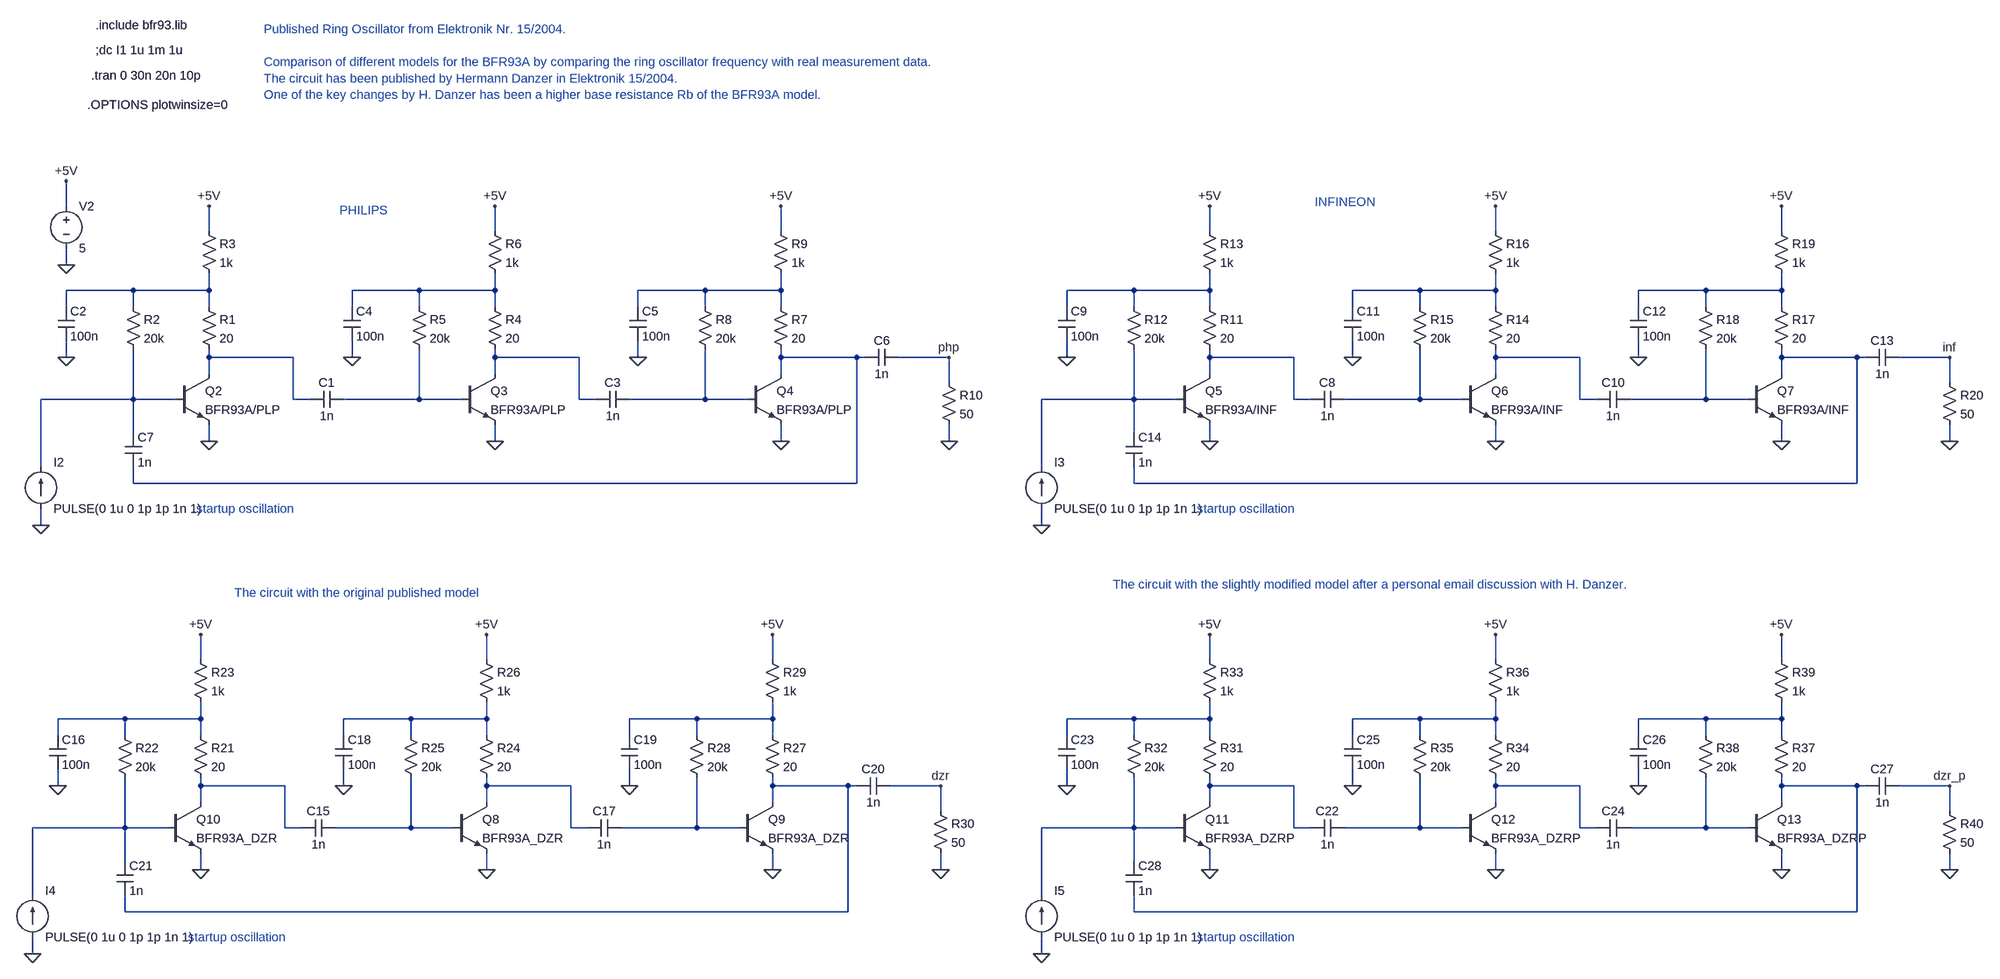
[diagram p0: schematic bfr93.asc]
bfr93.asc, the LTspice schematic file:
Version 4
SHEET 1 3400 3092
WIRE -304 1008 -304 1040
WIRE -304 784 -304 752
WIRE -304 752 -448 752
WIRE -304 752 -304 720
WIRE -576 752 -576 784
WIRE -448 784 -448 752
WIRE -448 752 -576 752
WIRE -304 864 -304 880
WIRE -368 960 -448 960
WIRE -448 960 -448 864
WIRE -576 848 -576 880
WIRE -304 640 -304 592
WIRE -112 960 -144 960
WIRE -144 960 -144 880
WIRE -144 880 -304 880
WIRE -304 880 -304 912
WIRE -48 960 96 960
WIRE 240 1008 240 1040
WIRE 240 784 240 752
WIRE 240 752 96 752
WIRE 240 752 240 720
WIRE -32 752 -32 784
WIRE 96 784 96 752
WIRE 96 752 -32 752
WIRE 240 864 240 880
WIRE 176 960 96 960
WIRE 96 960 96 864
WIRE -32 848 -32 880
WIRE 240 640 240 592
WIRE 432 960 400 960
WIRE 400 960 400 880
WIRE 400 880 240 880
WIRE 240 880 240 912
WIRE 496 960 640 960
WIRE 784 1008 784 1040
WIRE 784 784 784 752
WIRE 784 752 640 752
WIRE 784 752 784 720
WIRE 512 752 512 784
WIRE 640 784 640 752
WIRE 640 752 512 752
WIRE 784 864 784 880
WIRE 720 960 640 960
WIRE 640 960 640 864
WIRE 512 848 512 880
WIRE 784 640 784 592
WIRE 1104 1008 1104 1040
WIRE 1104 928 1104 880
WIRE 1104 880 1008 880
WIRE 784 880 784 912
WIRE 944 880 928 880
WIRE -448 1088 -448 1120
WIRE -448 1120 928 1120
WIRE 928 1120 928 880
WIRE 928 880 784 880
WIRE -448 1024 -448 960
WIRE -624 1088 -624 960
WIRE -624 960 -448 960
WIRE -624 1168 -624 1200
WIRE -576 672 -576 704
WIRE -576 592 -576 544
WIRE 1600 1008 1600 1040
WIRE 1600 784 1600 752
WIRE 1600 752 1456 752
WIRE 1600 752 1600 720
WIRE 1328 752 1328 784
WIRE 1456 784 1456 752
WIRE 1456 752 1328 752
WIRE 1600 864 1600 880
WIRE 1536 960 1456 960
WIRE 1456 960 1456 864
WIRE 1328 848 1328 880
WIRE 1600 640 1600 592
WIRE 1792 960 1760 960
WIRE 1760 960 1760 880
WIRE 1760 880 1600 880
WIRE 1600 880 1600 912
WIRE 1856 960 2000 960
WIRE 2144 1008 2144 1040
WIRE 2144 784 2144 752
WIRE 2144 752 2000 752
WIRE 2144 752 2144 720
WIRE 1872 752 1872 784
WIRE 2000 784 2000 752
WIRE 2000 752 1872 752
WIRE 2144 864 2144 880
WIRE 2080 960 2000 960
WIRE 2000 960 2000 864
WIRE 1872 848 1872 880
WIRE 2144 640 2144 592
WIRE 2336 960 2304 960
WIRE 2304 960 2304 880
WIRE 2304 880 2144 880
WIRE 2144 880 2144 912
WIRE 2400 960 2544 960
WIRE 2688 1008 2688 1040
WIRE 2688 784 2688 752
WIRE 2688 752 2544 752
WIRE 2688 752 2688 720
WIRE 2416 752 2416 784
WIRE 2544 784 2544 752
WIRE 2544 752 2416 752
WIRE 2688 864 2688 880
WIRE 2624 960 2544 960
WIRE 2544 960 2544 864
WIRE 2416 848 2416 880
WIRE 2688 640 2688 592
WIRE 3008 1008 3008 1040
WIRE 3008 928 3008 880
WIRE 3008 880 2912 880
WIRE 2688 880 2688 912
WIRE 2848 880 2832 880
WIRE 1456 1088 1456 1120
WIRE 1456 1120 2832 1120
WIRE 2832 1120 2832 880
WIRE 2832 880 2688 880
WIRE 1456 1024 1456 960
WIRE 1280 1088 1280 960
WIRE 1280 960 1456 960
WIRE 1280 1168 1280 1200
WIRE -320 1824 -320 1856
WIRE -320 1600 -320 1568
WIRE -320 1568 -464 1568
WIRE -320 1568 -320 1536
WIRE -592 1568 -592 1600
WIRE -464 1600 -464 1568
WIRE -464 1568 -592 1568
WIRE -320 1680 -320 1696
WIRE -384 1776 -464 1776
WIRE -464 1776 -464 1680
WIRE -592 1664 -592 1696
WIRE -320 1456 -320 1408
WIRE -128 1776 -160 1776
WIRE -160 1776 -160 1696
WIRE -160 1696 -320 1696
WIRE -320 1696 -320 1728
WIRE -64 1776 80 1776
WIRE 224 1824 224 1856
WIRE 224 1600 224 1568
WIRE 224 1568 80 1568
WIRE 224 1568 224 1536
WIRE -48 1568 -48 1600
WIRE 80 1600 80 1568
WIRE 80 1568 -48 1568
WIRE 224 1680 224 1696
WIRE 160 1776 80 1776
WIRE 80 1776 80 1680
WIRE -48 1664 -48 1696
WIRE 224 1456 224 1408
WIRE 416 1776 384 1776
WIRE 384 1776 384 1696
WIRE 384 1696 224 1696
WIRE 224 1696 224 1728
WIRE 480 1776 624 1776
WIRE 768 1824 768 1856
WIRE 768 1600 768 1568
WIRE 768 1568 624 1568
WIRE 768 1568 768 1536
WIRE 496 1568 496 1600
WIRE 624 1600 624 1568
WIRE 624 1568 496 1568
WIRE 768 1680 768 1696
WIRE 704 1776 624 1776
WIRE 624 1776 624 1680
WIRE 496 1664 496 1696
WIRE 768 1456 768 1408
WIRE 1088 1824 1088 1856
WIRE 1088 1744 1088 1696
WIRE 1088 1696 992 1696
WIRE 768 1696 768 1728
WIRE 928 1696 912 1696
WIRE -464 1904 -464 1936
WIRE -464 1936 912 1936
WIRE 912 1936 912 1696
WIRE 912 1696 768 1696
WIRE -464 1840 -464 1776
WIRE -640 1904 -640 1776
WIRE -640 1776 -464 1776
WIRE -640 1984 -640 2016
WIRE 1600 1824 1600 1856
WIRE 1600 1600 1600 1568
WIRE 1600 1568 1456 1568
WIRE 1600 1568 1600 1536
WIRE 1328 1568 1328 1600
WIRE 1456 1600 1456 1568
WIRE 1456 1568 1328 1568
WIRE 1600 1680 1600 1696
WIRE 1536 1776 1456 1776
WIRE 1456 1776 1456 1680
WIRE 1328 1664 1328 1696
WIRE 1600 1456 1600 1408
WIRE 1792 1776 1760 1776
WIRE 1760 1776 1760 1696
WIRE 1760 1696 1600 1696
WIRE 1600 1696 1600 1728
WIRE 1856 1776 2000 1776
WIRE 2144 1824 2144 1856
WIRE 2144 1600 2144 1568
WIRE 2144 1568 2000 1568
WIRE 2144 1568 2144 1536
WIRE 1872 1568 1872 1600
WIRE 2000 1600 2000 1568
WIRE 2000 1568 1872 1568
WIRE 2144 1680 2144 1696
WIRE 2080 1776 2000 1776
WIRE 2000 1776 2000 1680
WIRE 1872 1664 1872 1696
WIRE 2144 1456 2144 1408
WIRE 2336 1776 2304 1776
WIRE 2304 1776 2304 1696
WIRE 2304 1696 2144 1696
WIRE 2144 1696 2144 1728
WIRE 2400 1776 2544 1776
WIRE 2688 1824 2688 1856
WIRE 2688 1600 2688 1568
WIRE 2688 1568 2544 1568
WIRE 2688 1568 2688 1536
WIRE 2416 1568 2416 1600
WIRE 2544 1600 2544 1568
WIRE 2544 1568 2416 1568
WIRE 2688 1680 2688 1696
WIRE 2624 1776 2544 1776
WIRE 2544 1776 2544 1680
WIRE 2416 1664 2416 1696
WIRE 2688 1456 2688 1408
WIRE 3008 1824 3008 1856
WIRE 3008 1744 3008 1696
WIRE 3008 1696 2912 1696
WIRE 2688 1696 2688 1728
WIRE 2848 1696 2832 1696
WIRE 1456 1904 1456 1936
WIRE 1456 1936 2832 1936
WIRE 2832 1936 2832 1696
WIRE 2832 1696 2688 1696
WIRE 1456 1840 1456 1776
WIRE 1280 1904 1280 1776
WIRE 1280 1776 1456 1776
WIRE 1280 1984 1280 2016
FLAG -304 1040 0
FLAG -576 880 0
FLAG -304 592 +5V
FLAG -624 1200 0
FLAG 240 1040 0
FLAG -32 880 0
FLAG 240 592 +5V
FLAG 784 1040 0
FLAG 512 880 0
FLAG 784 592 +5V
FLAG 1104 1040 0
FLAG -576 544 +5V
FLAG -576 704 0
FLAG 1600 1040 0
FLAG 1328 880 0
FLAG 1600 592 +5V
FLAG 1280 1200 0
FLAG 2144 1040 0
FLAG 1872 880 0
FLAG 2144 592 +5V
FLAG 2688 1040 0
FLAG 2416 880 0
FLAG 2688 592 +5V
FLAG 3008 1040 0
FLAG 1104 880 php
FLAG 3008 880 inf
FLAG -320 1856 0
FLAG -592 1696 0
FLAG -320 1408 +5V
FLAG -640 2016 0
FLAG 224 1856 0
FLAG -48 1696 0
FLAG 224 1408 +5V
FLAG 768 1856 0
FLAG 496 1696 0
FLAG 768 1408 +5V
FLAG 1088 1856 0
FLAG 1088 1696 dzr
FLAG 1600 1856 0
FLAG 1328 1696 0
FLAG 1600 1408 +5V
FLAG 1280 2016 0
FLAG 2144 1856 0
FLAG 1872 1696 0
FLAG 2144 1408 +5V
FLAG 2688 1856 0
FLAG 2416 1696 0
FLAG 2688 1408 +5V
FLAG 3008 1856 0
FLAG 3008 1696 dzr_p
SYMBOL npn -368 912 R0
SYMATTR InstName Q2
SYMATTR Value BFR93A/PLP
SYMATTR Prefix X
SYMBOL res -320 768 R0
SYMATTR InstName R1
SYMATTR Value 20
SYMBOL res -464 768 R0
SYMATTR InstName R2
SYMATTR Value 20k
SYMBOL res -320 624 R0
SYMATTR InstName R3
SYMATTR Value 1k
SYMBOL cap -112 976 R270
WINDOW 0 32 32 VTop 0
WINDOW 3 0 32 VBottom 0
SYMATTR InstName C1
SYMATTR Value 1n
SYMBOL cap -592 784 R0
SYMATTR InstName C2
SYMATTR Value 100n
SYMBOL npn 176 912 R0
SYMATTR InstName Q3
SYMATTR Value BFR93A/PLP
SYMATTR Prefix X
SYMBOL res 224 768 R0
SYMATTR InstName R4
SYMATTR Value 20
SYMBOL res 80 768 R0
SYMATTR InstName R5
SYMATTR Value 20k
SYMBOL res 224 624 R0
SYMATTR InstName R6
SYMATTR Value 1k
SYMBOL cap 432 976 R270
WINDOW 0 32 32 VTop 0
WINDOW 3 0 32 VBottom 0
SYMATTR InstName C3
SYMATTR Value 1n
SYMBOL cap -48 784 R0
SYMATTR InstName C4
SYMATTR Value 100n
SYMBOL npn 720 912 R0
SYMATTR InstName Q4
SYMATTR Value BFR93A/PLP
SYMATTR Prefix X
SYMBOL res 768 768 R0
SYMATTR InstName R7
SYMATTR Value 20
SYMBOL res 624 768 R0
SYMATTR InstName R8
SYMATTR Value 20k
SYMBOL res 768 624 R0
SYMATTR InstName R9
SYMATTR Value 1k
SYMBOL cap 496 784 R0
SYMATTR InstName C5
SYMATTR Value 100n
SYMBOL cap 944 896 R270
WINDOW 0 32 32 VTop 0
WINDOW 3 0 32 VBottom 0
SYMATTR InstName C6
SYMATTR Value 1n
SYMBOL res 1088 912 R0
SYMATTR InstName R10
SYMATTR Value 50
SYMBOL cap -464 1024 R0
SYMATTR InstName C7
SYMATTR Value 1n
SYMBOL current -624 1168 M180
WINDOW 0 24 88 Left 0
WINDOW 3 24 0 Left 0
WINDOW 123 0 0 Left 0
WINDOW 39 0 0 Left 0
SYMATTR InstName I2
SYMATTR Value PULSE(0 1u 0 1p 1p 1n 1)
SYMBOL voltage -576 576 R0
SYMATTR InstName V2
SYMATTR Value 5
SYMBOL npn 1536 912 R0
SYMATTR InstName Q5
SYMATTR Value BFR93A/INF
SYMATTR Prefix X
SYMBOL res 1584 768 R0
SYMATTR InstName R11
SYMATTR Value 20
SYMBOL res 1440 768 R0
SYMATTR InstName R12
SYMATTR Value 20k
SYMBOL res 1584 624 R0
SYMATTR InstName R13
SYMATTR Value 1k
SYMBOL cap 1792 976 R270
WINDOW 0 32 32 VTop 0
WINDOW 3 0 32 VBottom 0
SYMATTR InstName C8
SYMATTR Value 1n
SYMBOL cap 1312 784 R0
SYMATTR InstName C9
SYMATTR Value 100n
SYMBOL npn 2080 912 R0
SYMATTR InstName Q6
SYMATTR Value BFR93A/INF
SYMATTR Prefix X
SYMBOL res 2128 768 R0
SYMATTR InstName R14
SYMATTR Value 20
SYMBOL res 1984 768 R0
SYMATTR InstName R15
SYMATTR Value 20k
SYMBOL res 2128 624 R0
SYMATTR InstName R16
SYMATTR Value 1k
SYMBOL cap 2336 976 R270
WINDOW 0 32 32 VTop 0
WINDOW 3 0 32 VBottom 0
SYMATTR InstName C10
SYMATTR Value 1n
SYMBOL cap 1856 784 R0
SYMATTR InstName C11
SYMATTR Value 100n
SYMBOL npn 2624 912 R0
SYMATTR InstName Q7
SYMATTR Value BFR93A/INF
SYMATTR Prefix X
SYMBOL res 2672 768 R0
SYMATTR InstName R17
SYMATTR Value 20
SYMBOL res 2528 768 R0
SYMATTR InstName R18
SYMATTR Value 20k
SYMBOL res 2672 624 R0
SYMATTR InstName R19
SYMATTR Value 1k
SYMBOL cap 2400 784 R0
SYMATTR InstName C12
SYMATTR Value 100n
SYMBOL cap 2848 896 R270
WINDOW 0 32 32 VTop 0
WINDOW 3 0 32 VBottom 0
SYMATTR InstName C13
SYMATTR Value 1n
SYMBOL res 2992 912 R0
SYMATTR InstName R20
SYMATTR Value 50
SYMBOL cap 1440 1024 R0
SYMATTR InstName C14
SYMATTR Value 1n
SYMBOL current 1280 1168 M180
WINDOW 0 24 88 Left 0
WINDOW 3 24 0 Left 0
WINDOW 123 0 0 Left 0
WINDOW 39 0 0 Left 0
SYMATTR InstName I3
SYMATTR Value PULSE(0 1u 0 1p 1p 1n 1)
SYMBOL res -336 1584 R0
SYMATTR InstName R21
SYMATTR Value 20
SYMBOL res -480 1584 R0
SYMATTR InstName R22
SYMATTR Value 20k
SYMBOL res -336 1440 R0
SYMATTR InstName R23
SYMATTR Value 1k
SYMBOL cap -128 1792 R270
WINDOW 0 32 32 VTop 0
WINDOW 3 0 32 VBottom 0
SYMATTR InstName C15
SYMATTR Value 1n
SYMBOL cap -608 1600 R0
SYMATTR InstName C16
SYMATTR Value 100n
SYMBOL res 208 1584 R0
SYMATTR InstName R24
SYMATTR Value 20
SYMBOL res 64 1584 R0
SYMATTR InstName R25
SYMATTR Value 20k
SYMBOL res 208 1440 R0
SYMATTR InstName R26
SYMATTR Value 1k
SYMBOL cap 416 1792 R270
WINDOW 0 32 32 VTop 0
WINDOW 3 0 32 VBottom 0
SYMATTR InstName C17
SYMATTR Value 1n
SYMBOL cap -64 1600 R0
SYMATTR InstName C18
SYMATTR Value 100n
SYMBOL res 752 1584 R0
SYMATTR InstName R27
SYMATTR Value 20
SYMBOL res 608 1584 R0
SYMATTR InstName R28
SYMATTR Value 20k
SYMBOL res 752 1440 R0
SYMATTR InstName R29
SYMATTR Value 1k
SYMBOL cap 480 1600 R0
SYMATTR InstName C19
SYMATTR Value 100n
SYMBOL cap 928 1712 R270
WINDOW 0 32 32 VTop 0
WINDOW 3 0 32 VBottom 0
SYMATTR InstName C20
SYMATTR Value 1n
SYMBOL res 1072 1728 R0
SYMATTR InstName R30
SYMATTR Value 50
SYMBOL cap -480 1840 R0
SYMATTR InstName C21
SYMATTR Value 1n
SYMBOL current -640 1984 M180
WINDOW 0 24 88 Left 0
WINDOW 3 24 0 Left 0
WINDOW 123 0 0 Left 0
WINDOW 39 0 0 Left 0
SYMATTR InstName I4
SYMATTR Value PULSE(0 1u 0 1p 1p 1n 1)
SYMBOL npn 1536 1728 R0
SYMATTR InstName Q11
SYMATTR Value BFR93A_DZRP
SYMATTR Prefix X
SYMBOL res 1584 1584 R0
SYMATTR InstName R31
SYMATTR Value 20
SYMBOL res 1440 1584 R0
SYMATTR InstName R32
SYMATTR Value 20k
SYMBOL res 1584 1440 R0
SYMATTR InstName R33
SYMATTR Value 1k
SYMBOL cap 1792 1792 R270
WINDOW 0 32 32 VTop 0
WINDOW 3 0 32 VBottom 0
SYMATTR InstName C22
SYMATTR Value 1n
SYMBOL cap 1312 1600 R0
SYMATTR InstName C23
SYMATTR Value 100n
SYMBOL npn 2080 1728 R0
SYMATTR InstName Q12
SYMATTR Value BFR93A_DZRP
SYMATTR Prefix X
SYMBOL res 2128 1584 R0
SYMATTR InstName R34
SYMATTR Value 20
SYMBOL res 1984 1584 R0
SYMATTR InstName R35
SYMATTR Value 20k
SYMBOL res 2128 1440 R0
SYMATTR InstName R36
SYMATTR Value 1k
SYMBOL cap 2336 1792 R270
WINDOW 0 32 32 VTop 0
WINDOW 3 0 32 VBottom 0
SYMATTR InstName C24
SYMATTR Value 1n
SYMBOL cap 1856 1600 R0
SYMATTR InstName C25
SYMATTR Value 100n
SYMBOL npn 2624 1728 R0
SYMATTR InstName Q13
SYMATTR Value BFR93A_DZRP
SYMATTR Prefix X
SYMBOL res 2672 1584 R0
SYMATTR InstName R37
SYMATTR Value 20
SYMBOL res 2528 1584 R0
SYMATTR InstName R38
SYMATTR Value 20k
SYMBOL res 2672 1440 R0
SYMATTR InstName R39
SYMATTR Value 1k
SYMBOL cap 2400 1600 R0
SYMATTR InstName C26
SYMATTR Value 100n
SYMBOL cap 2848 1712 R270
WINDOW 0 32 32 VTop 0
WINDOW 3 0 32 VBottom 0
SYMATTR InstName C27
SYMATTR Value 1n
SYMBOL res 2992 1728 R0
SYMATTR InstName R40
SYMATTR Value 50
SYMBOL cap 1440 1840 R0
SYMATTR InstName C28
SYMATTR Value 1n
SYMBOL current 1280 1984 M180
WINDOW 0 24 88 Left 0
WINDOW 3 24 0 Left 0
WINDOW 123 0 0 Left 0
WINDOW 39 0 0 Left 0
SYMATTR InstName I5
SYMATTR Value PULSE(0 1u 0 1p 1p 1n 1)
SYMBOL npn 160 1728 R0
SYMATTR InstName Q8
SYMATTR Value BFR93A_DZR
SYMBOL npn 704 1728 R0
SYMATTR InstName Q9
SYMATTR Value BFR93A_DZR
SYMBOL npn -384 1728 R0
SYMATTR InstName Q10
SYMATTR Value BFR93A_DZR
TEXT -520 232 Left 0 !.include bfr93.lib
TEXT -520 280 Left 0 !;dc I1 1u 1m 1u
TEXT -528 328 Left 0 !.tran 0 30n 20n 10p
TEXT -536 384 Left 0 !.OPTIONS plotwinsize=0
TEXT -328 1168 Left 0 ;startup oscillation
TEXT 1576 1168 Left 0 ;startup oscillation
TEXT -344 1984 Left 0 ;startup oscillation
TEXT 1576 1984 Left 0 ;startup oscillation
TEXT -56 600 Left 0 ;PHILIPS
TEXT 1800 584 Left 0 ;INFINEON
TEXT -200 240 Left 0 ;Published Ring Oscillator from Elektronik Nr. 15/2004.\n \nComparison of different models for the BFR93A by comparing the ring oscillator frequency with real measurement data.\nThe circuit has been published by Hermann Danzer in Elektronik 15/2004.\nOne of the key changes by H. Danzer has been a higher base resistance Rb of the BFR93A model.
TEXT -256 1328 Left 0 ;The circuit with the original published model
TEXT 1416 1312 Left 0 ;The circuit with the slightly modified model after a personal email discussion with H. Danzer.

The netlist it stands for:
* bfr93.asc
XQ2 N002 N003 0 BFR93A/PLP  ; pins C B E
R1 N001 N002 20
R2 N001 N003 20k
R3 +5V N001 1k
C1 N002 N004 1n
C2 N001 0 100n
XQ3 N006 N004 0 BFR93A/PLP  ; pins C B E
R4 N005 N006 20
R5 N005 N004 20k
R6 +5V N005 1k
C3 N006 N007 1n
C4 N005 0 100n
XQ4 N009 N007 0 BFR93A/PLP  ; pins C B E
R7 N008 N009 20
R8 N008 N007 20k
R9 +5V N008 1k
C5 N008 0 100n
C6 N009 php 1n
R10 php 0 50
C7 N003 N009 1n
I2 0 N003 PULSE(0 1u 0 1p 1p 1n 1)
V2 +5V 0 5
XQ5 N011 N012 0 BFR93A/INF  ; pins C B E
R11 N010 N011 20
R12 N010 N012 20k
R13 +5V N010 1k
C8 N011 N013 1n
C9 N010 0 100n
XQ6 N015 N013 0 BFR93A/INF  ; pins C B E
R14 N014 N015 20
R15 N014 N013 20k
R16 +5V N014 1k
C10 N015 N016 1n
C11 N014 0 100n
XQ7 N018 N016 0 BFR93A/INF  ; pins C B E
R17 N017 N018 20
R18 N017 N016 20k
R19 +5V N017 1k
C12 N017 0 100n
C13 N018 inf 1n
R20 inf 0 50
C14 N012 N018 1n
I3 0 N012 PULSE(0 1u 0 1p 1p 1n 1)
R21 N019 N020 20
R22 N019 N021 20k
R23 +5V N019 1k
C15 N020 N022 1n
C16 N019 0 100n
R24 N023 N024 20
R25 N023 N022 20k
R26 +5V N023 1k
C17 N024 N025 1n
C18 N023 0 100n
R27 N026 N027 20
R28 N026 N025 20k
R29 +5V N026 1k
C19 N026 0 100n
C20 N027 dzr 1n
R30 dzr 0 50
C21 N021 N027 1n
I4 0 N021 PULSE(0 1u 0 1p 1p 1n 1)
XQ11 N029 N030 0 BFR93A_DZRP  ; pins C B E
R31 N028 N029 20
R32 N028 N030 20k
R33 +5V N028 1k
C22 N029 N031 1n
C23 N028 0 100n
XQ12 N033 N031 0 BFR93A_DZRP  ; pins C B E
R34 N032 N033 20
R35 N032 N031 20k
R36 +5V N032 1k
C24 N033 N034 1n
C25 N032 0 100n
XQ13 N036 N034 0 BFR93A_DZRP  ; pins C B E
R37 N035 N036 20
R38 N035 N034 20k
R39 +5V N035 1k
C26 N035 0 100n
C27 N036 dzr_p 1n
R40 dzr_p 0 50
C28 N030 N036 1n
I5 0 N030 PULSE(0 1u 0 1p 1p 1n 1)
Q8 N024 N022 0 0 BFR93A_DZR
Q9 N027 N025 0 0 BFR93A_DZR
Q10 N020 N021 0 0 BFR93A_DZR
.model NPN NPN
.model PNP PNP
.lib standard.bjt
.include bfr93.lib
;dc I1 1u 1m 1u
.tran 0 30n 20n 10p
.OPTIONS plotwinsize=0
* startup oscillation
* startup oscillation
* startup oscillation
* startup oscillation
* PHILIPS
* INFINEON
* Published Ring Oscillator from Elektronik Nr. 15/2004.
* Comparison of different models for the BFR93A by comparing the ring oscillator frequency with real measurement data.
* The circuit has been published by Hermann Danzer in Elektronik 15/2004.
* One of the key changes by H. Danzer has been a higher base resistance Rb of the BFR93A model.
* The circuit with the original published model
* The circuit with the slightly modified model after a personal email discussion with H. Danzer.
.backanno
.end